# EAGLE design TiltyDuo (EAGLE 6.4)
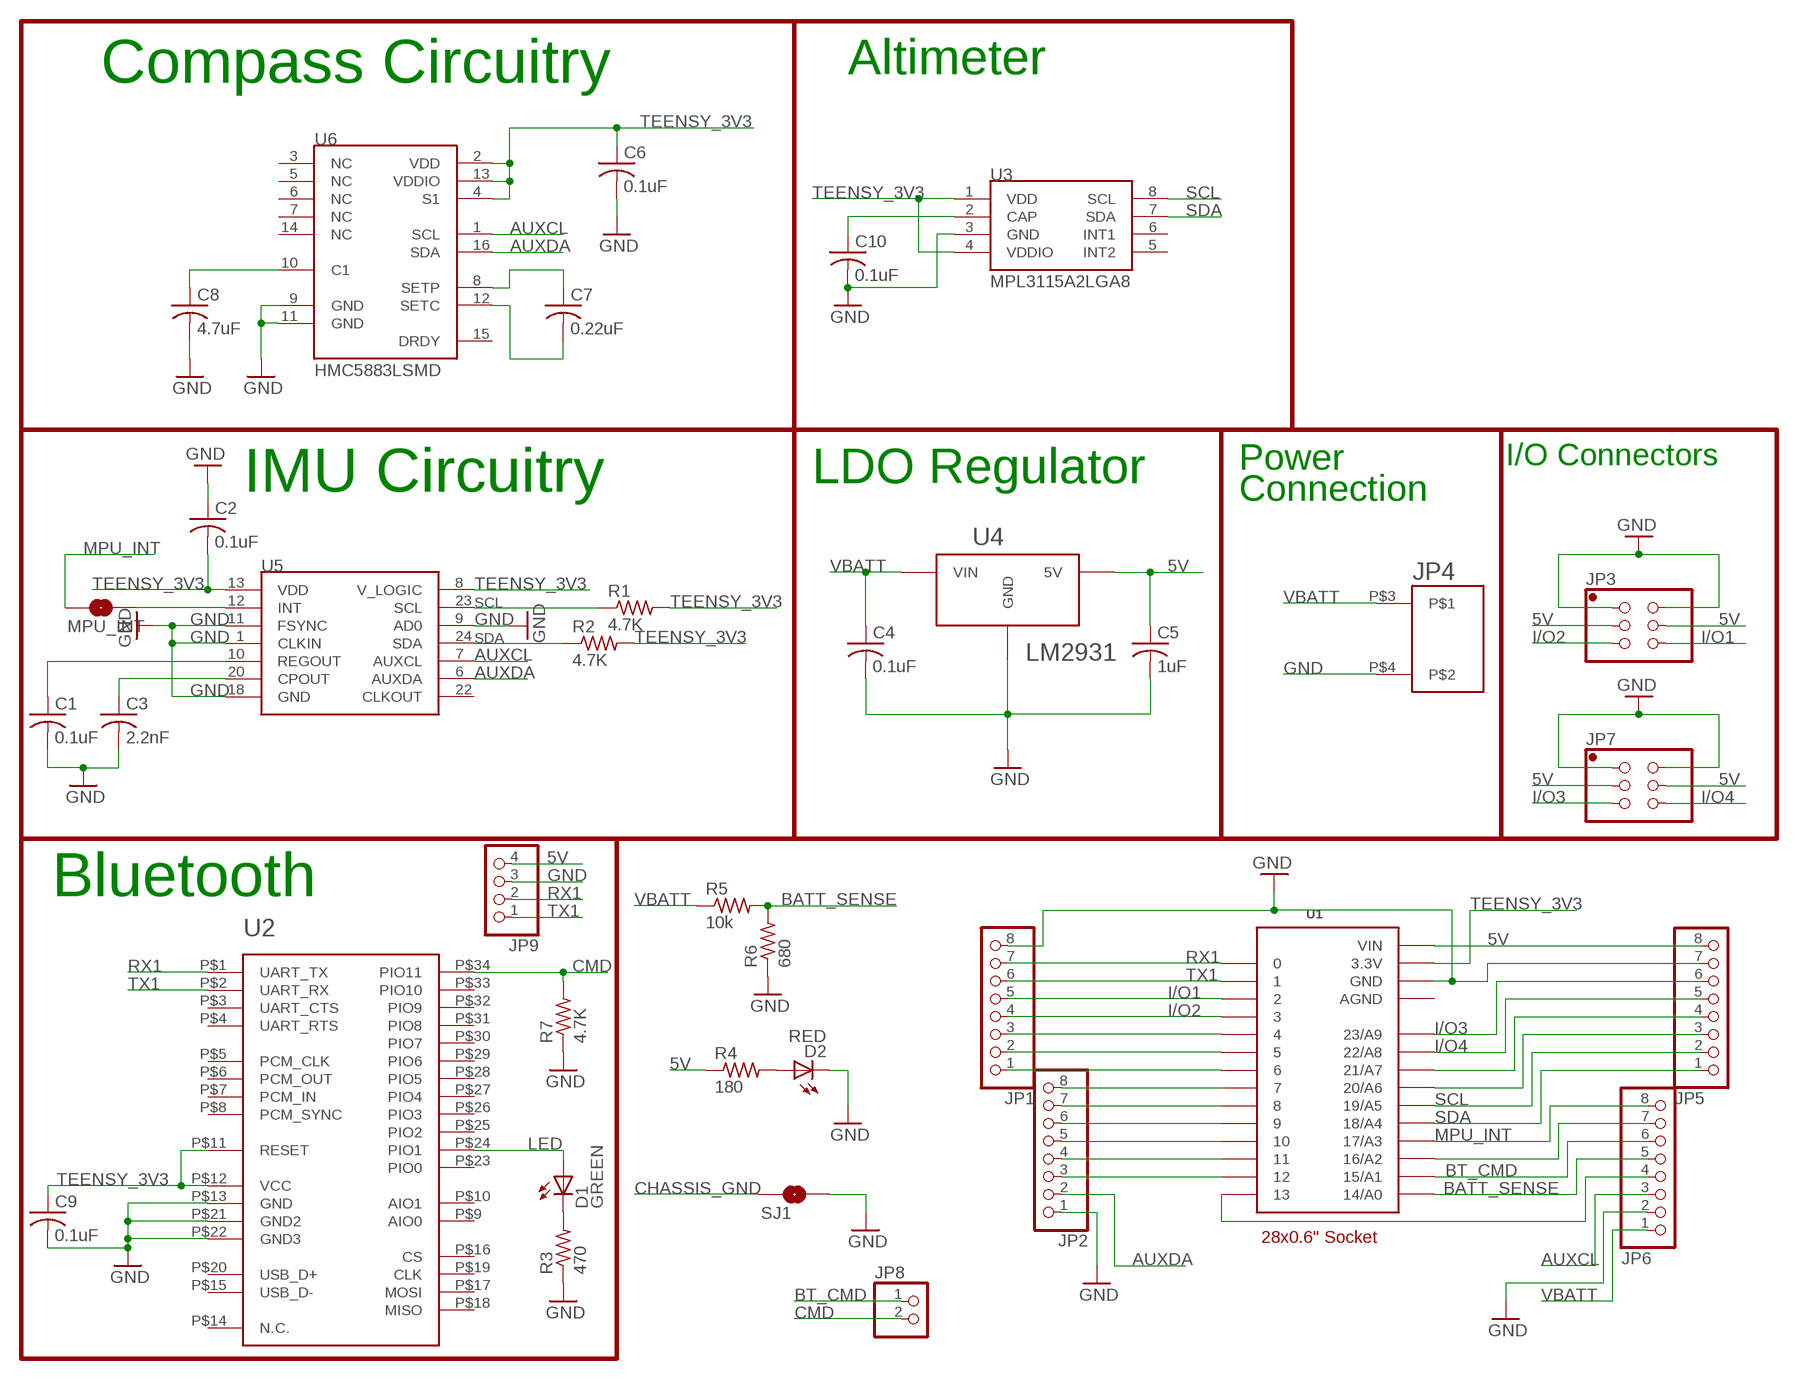
[diagram p0: schematic, sheet 1]

## Parts
C1  0.1uF  C-USC0402  [C0402]
C2  0.1uF  C-USC0402  [C0402]
C3  2.2nF  C-USC0402  [C0402]
C4  0.1uF  C-USC0603  [C0603]
C5  1uF  C-USC0603  [C0603]
C6  0.1uF  C-USC0402  [C0402]
C7  0.22uF  C-USC0402  [C0402]
C8  4.7uF  C-USC0402  [C0402]
C9  0.1uF  C-USC0402  [C0402]
C10  0.1uF  C-USC0402  [C0402]
D1  GREEN  LED-GREEN1206_NO_SILK  [LED-1206_NO_SS]
D2  RED  LED-GREEN1206_NO_SILK  [LED-1206_NO_SS]
JP1  PINHD-1X81X08_NO_SILK  [1X08_NO_SS]
JP2  PINHD-1X81X08_NO_SILK  [1X08_NO_SS]
JP3  PINHD-2X32X03_NO_SILK  [2X03_NO_SS]
JP4  2-POS_SMD_TERM_BLOCK  [2-POS_SMD_TERMINAL_BLOCK]
JP5  PINHD-1X81X08_NO_SILK  [1X08_NO_SS]
JP6  PINHD-1X81X08_NO_SILK  [1X08_NO_SS]
JP7  PINHD-2X32X03_NO_SILK  [2X03_NO_SS]
JP8  PINHD-1X21X02_NO_SILK  [1X02_NO_SS]
JP9  PINHD-1X4  [1X04]
MPU_INT  SOLDERJUMPERNO  [SJ_2S-NO]
R1  4.7K  R-US_R0402  [R0402]
R2  4.7K  R-US_R0402  [R0402]
R3  470  R-US_R0603  [R0603]
R4  180  R-US_R0603  [R0603]
R5  10k  R-US_R0603  [R0603]
R6  680  R-US_R0603  [R0603]
R7  4.7K  R-US_R0402  [R0402]
SJ1  SOLDERJUMPERNO  [SJ_2S-NO]
U1  TEENSY_3.0_OUTER-PINS28-DIP_SOCKET  [28-DIP]
U2  HC-09_BREAKOUT  [HC-09_BREAKOUT]
U3  MPL3115A2LGA8  [LGA8]
U4  LM2931  [TO263]
U5  MPU-6050  [QFN-24]
U6  HMC5883LSMD  [16LPCC]

## Nets
5V: C5.1 JP3.3 JP3.4 JP5.8 JP7.3 JP7.4 JP9.4 R4.1 U1.P$15(VIN) U4.P$3(5V)
AUXCL [I/O]: JP6.3 U5.7(AUXCL) U6.1(SCL)
AUXDA [I/O]: JP2.2 U5.6(AUXDA) U6.16(SDA)
BATT_SENSE: JP6.5 R5.2 R6.2 U1.P$27(14/A0)
BT_CMD: JP6.6 JP8.1 U1.P$26(15/A1)
CHASSIS_GND: SJ1.1
CMD: JP8.2 R7.2 U2.P$34(PIO11)
GND: C1.2 C2.1 C3.2 C4.2 C5.2 C6.2 C8.2 C9.2 C10.2 D2.C JP1.8 JP2.1 JP3.1 JP3.2 JP4.P$4 JP5.7 JP6.2 JP7.1 JP7.2 JP9.3 R3.1 R6.1 R7.1 SJ1.2 U1.P$1(GND) U2.P$13(GND) U2.P$21(GND2) U2.P$22(GND3) U3.3(GND) U4.P$1(GND) U5.1(CLKIN) U5.9(AD0) U5.11(FSYNC) U5.18(GND) U6.9(GND) U6.11(GND)
I/O1: JP1.5 JP3.6 U1.P$4
I/O2: JP1.4 JP3.5 U1.P$5
I/O3: JP5.6 JP7.5 U1.P$18(23/A9)
I/O4: JP5.5 JP7.6 U1.P$19(22/A8)
LED: D1.A U2.P$24(PIO1)
MPU_INT: JP6.8 MPU_INT.1 U1.P$24(17/A3)
N$1: C1.1 U5.10(REGOUT)
N$2: C3.1 U5.20(CPOUT)
N$3: D1.C R3.2
N$5: C7.1 U6.8(SETP)
N$6: C7.2 U6.12(SETC)
N$7: JP1.3 U1.P$6
N$8: JP1.2 U1.P$7
N$9: JP1.1 U1.P$8
N$10: JP6.4 U1.P$28
N$11: C8.1 U6.10(C1)
N$12: JP2.6 U1.P$11
N$13: JP2.5 U1.P$12
N$14: JP2.4 U1.P$13
N$15: JP2.3 U1.P$14
N$16: MPU_INT.2 U5.12(INT)
N$17: D2.A R4.2
N$18: JP5.4 U1.P$20(21/A7)
N$19: JP5.3 U1.P$21(20/A6)
N$21: C10.1 U3.2(CAP)
N$23: JP6.7 U1.P$25(16/A2)
RX1: JP1.7 JP9.2 U1.P$2 U2.P$1(UART_TX)
RX3: JP2.8 U1.P$9
SCL [I/O]: JP5.2 R1.1 U1.P$22(19/A5) U3.8(SCL) U5.23(SCL)
SDA [I/O]: JP5.1 R2.1 U1.P$23(18/A4) U3.7(SDA) U5.24(SDA)
TEENSY_3V3 [3.3V]: C2.2 C6.1 C9.1 R1.2 R2.2 U1.P$17(3.3V) U2.P$11(RESET) U2.P$12(VCC) U3.1(VDD) U3.4(VDDIO) U5.8(V_LOGIC) U5.13(VDD) U6.2(VDD) U6.4(S1) U6.13(VDDIO)
TX1: JP1.6 JP9.1 U1.P$3 U2.P$2(UART_RX)
TX3: JP2.7 U1.P$10
VBATT: C4.1 JP4.P$3 JP6.1 R5.1 U4.P$2(VIN)
Unconnected: U2.P$3(UART_CTS) U2.P$4(UART_RTS) U2.P$5(PCM_CLK) U2.P$6(PCM_OUT) U2.P$7(PCM_IN) U2.P$8(PCM_SYNC) U2.P$9(AIO0) U2.P$10(AIO1) U2.P$14(N.C.) U2.P$15(USB_D-) U2.P$16(CS) U2.P$17(MOSI) U2.P$18(MISO) U2.P$19(CLK) U2.P$20(USB_D+) U2.P$23(PIO0) U2.P$25(PIO2) U2.P$26(PIO3) U2.P$27(PIO4) U2.P$28(PIO5) U2.P$29(PIO6) U2.P$30(PIO7) U2.P$31(PIO8) U2.P$32(PIO9) U2.P$33(PIO10) U3.5(INT2) U3.6(INT1) U5.22(CLKOUT) U6.3(NC) U6.5(NC) U6.6(NC) U6.7(NC) U6.14(NC) U6.15(DRDY)

## Notes on the sheet
- Compass Circuitry | Altimeter
- Power | I/O Connectors
- IMU Circuitry | LDO Regulator
- Connection
- Bluetooth
- 28x0.6" Socket

## Power pins joined to a net without a drawn wire
AGND: U1.P$16(AGND)

## Library data of the parts
C1 C6 C9 C10 = resistor:C-US: CAPACITOR, American symbol; RATED_VOLTAGE: 2
C2 C4 C5 C7 C8 = resistor:C-US: CAPACITOR, American symbol
C3 = resistor:C-US: CAPACITOR, American symbol; RATED_VOLTAGE: 50
D1 D2 = SparkFun-LED:LED-GREEN: Various green LEDs 0603- DIO-00821 LARGE- DIO-00862 LILYPAD- DIO-09910
JP1 JP2 JP5 JP6 = pinhead:PINHD-1X8: PIN HEADER
JP3 JP7 = pinhead:PINHD-2X3: PIN HEADER
JP4 = My Parts:2-POS_SMD_TERM_BLOCK
JP8 = pinhead:PINHD-1X2: PIN HEADER
JP9 = pinhead:PINHD-1X4: PIN HEADER
MPU_INT SJ1 = SparkFun-Passives:SOLDERJUMPER: Solder Jumper Standard SMD solder jumper. Used to automate production. Two varients : Normally Open and Normally Closed are the same, but have different paste layers. NC will have a large amount of paste and should jumper during reflow.
R1-R7 = resistor:R-US_: RESISTOR, American symbol
U1 = My Parts:TEENSY_3.0_OUTER-PINS; COST: 0.28
U2 = csr:HC-09_BREAKOUT
U3 = SparkFun-Sensors:MPL3115A2: Altimeter/Pressure Sensor, I2C, 1.95V-3.6V supply, 50 to 110kPa
U4 = on-semiconductor:LM2931; COST: 0.53
U5 = SparkFun-Sensors:MPU-6050: MPU-6000 - I2C address is 0x68 with AD0 low and 0x69 with AD0 high.
U6 = SparkFun:HMC5883L: 3 Axis Digital Compass IC

## Board
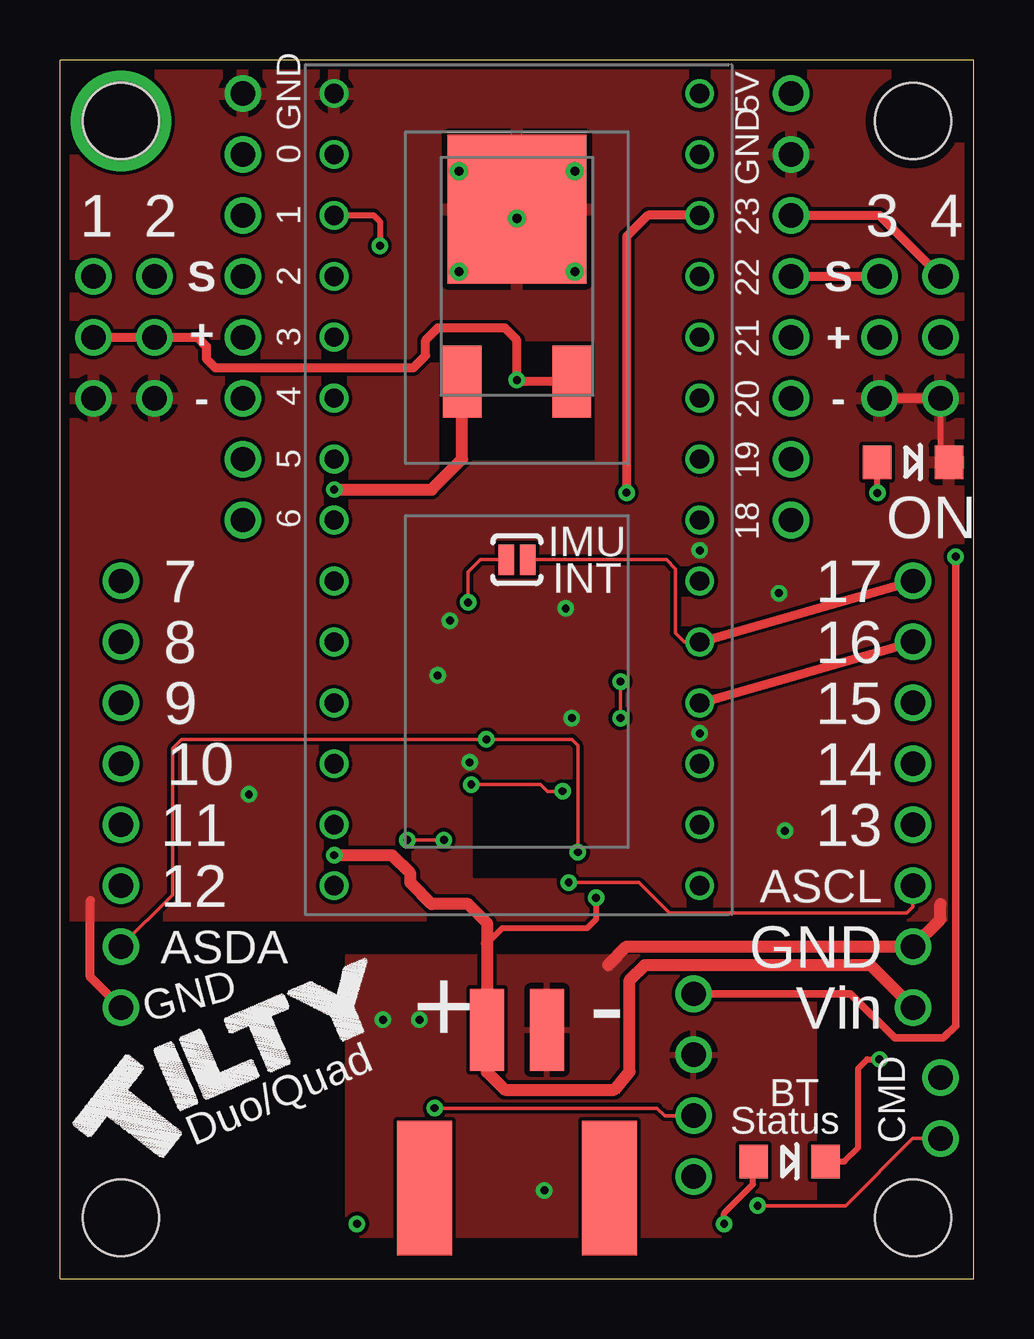
[diagram p1: board, top side]
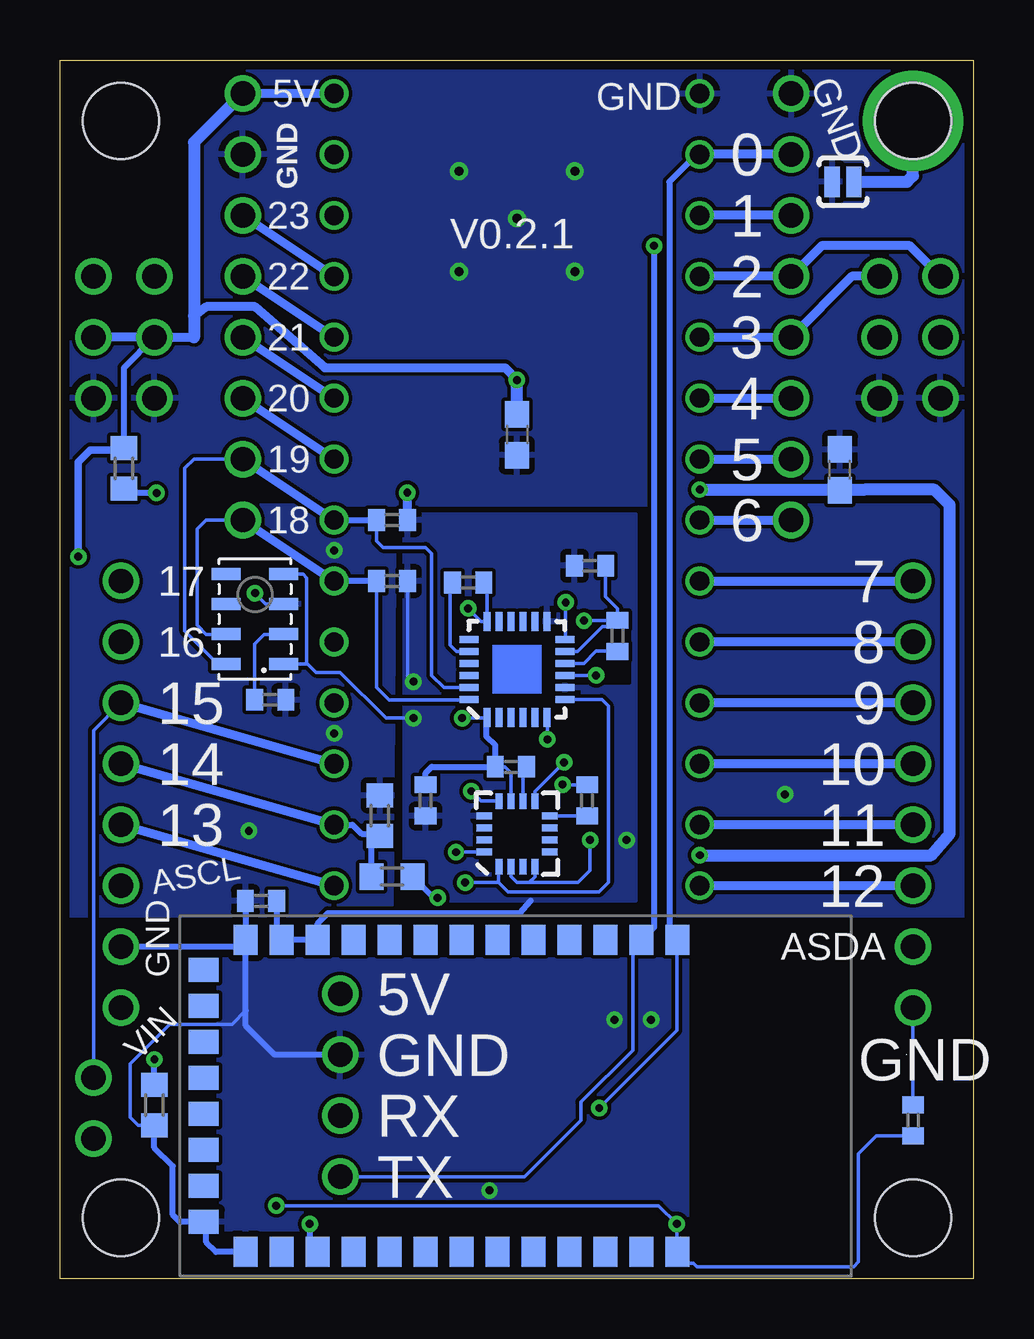
[diagram p2: board, bottom side, seen from below]

Size 38.1 x 50.8 mm. Coordinates in mm from the lower left corner, seen from the top.
Outline: 0,0 38.1,0 38.1,50.8 0,50.8 0,0
Copper layers (1*16): Top 0.0356mm / dielectric 1.5011mm / Bottom 0.0356mm
Design rules "LaenPCBOrder": minimum track width 6mil, minimum drill 13mil, track to track 6mil, track to pad 6mil, pad to pad 6mil, via to via 6mil, smd to smd 6mil, copper to edge 15mil, drill to drill 6mil, minimum pad ring 7mil, minimum via ring 7mil, stop-mask expansion 4mil, vias tented up to drill 0mil, thermal gap 10mil
Holes 3.17 mm at 35.56,48.26 35.56,2.54 2.54,2.54 2.54,48.26

### Footprints (pad centres in the part's own frame; a part is rotated, then mirrored left to right if it is on the bottom)
C0402 = smd 0.7 x 0.9: 1 -0.65,0; 2 0.65,0
C0603 = smd 1.1 x 1: 1 -0.85,0; 2 0.85,0
LED-1206_NO_SS = smd 1.2 x 1.4: A -1.5,0; C 1.5,0
1X08_NO_SS = drill 1.016: 1 -8.89,0; 2 -6.35,0; 3 -3.81,0; 4 -1.27,0; 5 1.27,0; 6 3.81,0; 7 6.35,0; 8 8.89,0
2X03_NO_SS = drill 1.016: 1 -2.54,-1.27; 2 -2.54,1.27; 3 0,-1.27; 4 0,1.27; 5 2.54,-1.27; 6 2.54,1.27
2-POS_SMD_TERMINAL_BLOCK = smd 2.3 x 5.6: P$1 -3.85,-2.325; P$2 3.85,-2.325 | smd 1.4 x 3.4: P$3 -1.25,4.275; P$4 1.25,4.275
1X02_NO_SS = drill 1.016: 1 -1.27,0; 2 1.27,0
1X04 = drill 1.016: 1 -3.81,0; 2 -1.27,0; 3 1.27,0; 4 3.81,0
SJ_2S-NO = smd 0.635 x 1.27: 1 -0.45,0; 2 0.45,0
R0402 = smd 0.7 x 0.9: 1 -0.65,0; 2 0.65,0
R0603 = smd 1 x 1.1: 1 -0.85,0; 2 0.85,0
28-DIP = drill 0.8: P$1 -7.62,16.51; P$2 -7.62,13.97; P$3 -7.62,11.43; P$4 -7.62,8.89; P$5 -7.62,6.35; P$6 -7.62,3.81; P$7 -7.62,1.27; P$8 -7.62,-1.27; P$9 -7.62,-3.81; P$10 -7.62,-6.35; P$11 -7.62,-8.89; P$12 -7.62,-11.43; P$13 -7.62,-13.97; P$14 -7.62,-16.51; P$15 7.62,16.51; P$16 7.62,13.97; P$17 7.62,11.43; P$18 7.62,8.89; P$19 7.62,6.35; P$20 7.62,3.81; P$21 7.62,1.27; P$22 7.62,-1.27; P$23 7.62,-3.81; P$24 7.62,-6.35; P$25 7.62,-8.89; P$26 7.62,-11.43; P$27 7.62,-13.97; P$28 7.62,-16.51
HC-09_BREAKOUT = smd 1.25 x 1: P$1 -6.5,10.5; P$2 -6.5,9; P$3 -6.5,7.5; P$4 -6.5,6; P$5 -6.5,3; P$6 -6.5,4.5; P$7 -6.5,1.5; P$8 -6.5,0; P$9 -6.5,-1.5; P$10 -6.5,-3; P$11 -6.5,-4.5; P$12 -6.5,-6; P$13 -6.5,-7.5; P$22 6.5,-7.5; P$23 6.5,-6; P$24 6.5,-4.5; P$25 6.5,-3; P$26 6.5,-1.5; P$27 6.5,0; P$28 6.5,1.5; P$29 6.5,3; P$30 6.5,4.5; P$31 6.5,6; P$32 6.5,7.5; P$33 6.5,9; P$34 6.5,10.5 | smd 1 x 1.25: P$14 -5.25,-9.25; P$15 -3.75,-9.25; P$16 -2.25,-9.25; P$17 -0.75,-9.25; P$18 0.75,-9.25; P$19 2.25,-9.25; P$20 3.75,-9.25; P$21 5.25,-9.25
LGA8 = smd 1.2 x 0.5: 1 -1.2,1.875; 2 -1.2,0.625; 3 -1.2,-0.625; 4 -1.2,-1.875; 5 1.2,-1.875; 6 1.2,-0.625; 7 1.2,0.625; 8 1.2,1.875
TO263 = smd 5.791 x 6.198: P$1 0,2.794 | smd 1.6 x 2.997: P$2 -2.286,-4.394; P$3 2.286,-4.394
QFN-24 = smd 0.8 x 0.3: 1 -2,1.25; 2 -2,0.75; 3 -2,0.25; 4 -2,-0.25; 5 -2,-0.75; 6 -2,-1.25; 13 2,-1.25; 14 2,-0.75; 15 2,-0.25; 16 2,0.25; 17 2,0.75; 18 2,1.25 | smd 0.3 x 0.8: 7 -1.25,-2; 8 -0.75,-2; 9 -0.25,-2; 10 0.25,-2; 11 0.75,-2; 12 1.25,-2; 19 1.25,2; 20 0.75,2; 21 0.25,2; 22 -0.25,2; 23 -0.75,2; 24 -1.25,2
16LPCC = smd 0.65 x 0.28: 1 -1.37,0.75; 2 -1.37,0.25; 3 -1.37,-0.25; 4 -1.37,-0.75; 9 1.37,-0.75; 10 1.37,-0.25; 11 1.37,0.25; 12 1.37,0.75 | smd 0.28 x 0.65: 5 -0.75,-1.37; 6 -0.25,-1.37; 7 0.25,-1.37; 8 0.75,-1.37; 13 0.75,1.37; 14 0.25,1.37; 15 -0.25,1.37; 16 -0.75,1.37

### Placement (x,y rotation side)
C1  14.86,26.8 90 bottom
C2  16,29.72 180 bottom
C3  21.08,29.02 0 bottom
C4  5.59,33.72 90 bottom
C5  19.05,35.18 270 bottom
C6  22.86,19.94 90 bottom
C7  16.13,19.94 90 bottom
C8  19.3,21.34 180 bottom
C9  29.72,15.75 180 bottom
C10  29.34,24.13 0 bottom
D1  30.42,4.89 0 top
D2  35.56,34.04 0 top
JP1  7.62,40.51 90 top
JP2  2.54,20.19 90 top
JP3  2.67,39.24 90 top
JP4  19.05,6.1 0 top
JP5  30.48,40.51 90 top
JP6  35.56,20.19 90 top
JP7  35.43,39.24 90 top
JP8  36.7,7.11 270 top
JP9  26.42,8.06 90 top
MPU_INT  19.05,29.97 180 top
R1  24.26,31.62 0 bottom
R2  24.26,29.08 0 bottom
R3  34.16,7.24 90 bottom
R4  35.43,33.78 270 bottom
R5  24.26,16.76 180 bottom
R6  24.77,19.3 270 bottom
R7  2.54,6.6 270 bottom
SJ1  5.46,45.72 180 bottom
U1  19.05,32.89 0 top
U2  22.86,7.62 270 bottom
U3  29.97,27.5 180 bottom
U4  19.05,41.78 0 top
U5  19.05,25.4 90 bottom
U6  19.05,18.54 90 bottom

### Tracks (layer width: path | path; a pad name or v marks a point on that pad's centre or on a via)
5V  (via drill 0.33)
  Top 0.318: JP9.4 32.96,11.87 34.8,10.03 36.83,10.03 37.34,10.54 v37.34,30.1
  Top 0.381: U4.P$3 19.13,37.39 v19.05,37.47 19.05,39.12 18.54,39.62 15.75,39.62 15.24,39.12 15.24,38.48 14.73,37.97 6.48,37.97 6.1,38.35 6.1,38.86 5.71,39.24 JP3.3 JP3.4
  Bottom 0.254: JP7.4 35.43,37.97 R4.1
  Bottom 0.318: v37.34,30.1 37.34,34.04 36.83,34.54 35.52,34.54 R4.1
  Bottom 0.381: U1.P$15 JP5.8 | 32.51,39.24 JP7.4 JP7.3 | v19.05,37.47 19.56,37.97 27.05,37.97 29.97,40.51 32,40.51 32.51,40.13
  Bottom 0.508: JP5.8 32.51,47.37 32.51,40.13 32.51,39.24 | C5.1 v19.05,37.47
AUXCL  (via drill 0.33)
  Top 0.152: v21.21,16.51 24.13,16.51 25.4,15.24 35.31,15.24 35.56,15.49 JP6.3
  Bottom 0.152: U5.7 15.51,24.15 15.24,23.88 15.24,16.51 15.62,16.13 19.43,16.13 19.81,16.51 | 19.81,16.51 19.81,17.16 U6.1 | 19.81,16.51 v21.21,16.51
AUXDA  (via drill 0.33)
  Top 0.152: v21.59,17.78 21.59,22.23 21.34,22.48 v17.78,22.48 5.08,22.48 4.7,22.1 4.7,16 JP2.2
  Bottom 0.152: v17.78,22.48 17.78,23.38 U5.6 | U6.16 21.32,17.79 v21.59,17.78
BATT_SENSE
  Bottom 0.254: R5.2 25.11,18.11 R6.2 24.85,18.54 25.53,18.54 25.91,18.92 U1.P$27
  Bottom 0.381: U1.P$27 JP6.5
BT_CMD
  Bottom 0.152: JP8.1 36.7,22.86 JP6.6
  Bottom 0.381: U1.P$26 JP6.6
CHASSIS_GND  (via drill 3.17)
  Bottom 0.508: SJ1.1 2.79,45.72 2.54,45.97 v2.54,48.26
CMD  (via drill 0.33)
  Top 0.152: JP8.2 35.56,5.84 32.77,3.05 v29.08,3.05
  Bottom 0.152: v29.08,3.05 13.14,3.05 v12.38,2.29 12.38,1.14 U2.P$34 | 12.38,1.1 U2.P$34 | R7.2 4.08,5.95 4.83,5.21 4.83,0.7 5.02,0.51 11.56,0.51 11.68,0.64 12,0.64 U2.P$34
GND  (via drill 0.33, 0.38 pad 0.18)
  Top 0.254: JP7.1 36.7,34.39 D2.C
  Top 0.381: JP7.2 JP7.1 | JP2.1 1.27,12.57 1.27,15.75
  Top 0.508: 36.7,15.62 36.7,14.99 JP6.2 23.62,13.84 22.86,13.08
  Bottom 0.152: C8.2 19.56,21.34 19.3,21.08 U6.11 | C3.2 20.3,28.9 U5.18 20.54,27.4 v21.08,27.94 | v15.75,25.15 U5.9 | U5.11 16.52,26.15 15.49,27.18 15.13,27.18 C1.2 | v16.26,27.43 14.87,27.43 C1.2 | 20.32,23.38 21.32,23.38 v21.34,23.37 | C2.1 15.35,28.43 14.86,27.94 C1.2 | U6.9 18.3,20.31 v17.08,21.53 | R3.1 34.84,6.39 35.18,6.73 35.18,8.95 33.53,10.6 30.92,10.6 30.35,11.18 | R7.1 JP2.1 | U3.3 29.52,28.12 v29.97,28.57
  Bottom 0.254: C6.2 22.86,21.08 22.61,21.34 C8.2 19.95,22.24 20.32,22.61 20.32,23.38 U5.1 | JP6.2 30.64,13.84 U2.P$13 | U2.P$22 31.6,1.12 32,1.52 32,2.26 U2.P$21 33.1,2.37 33.4,2.67 33.4,4.7 34.16,5.46 R3.1 | C9.2 U2.P$13 | U2.P$13 30.36,13.98 | JP9.3 29.15,9.34 30.35,10.54 30.35,11.18 U2.P$13
  other vias: 19.05,44.2 16.64,41.97 21.46,41.97 21.46,46.16 16.64,46.16 7.87,20.19 26.67,30.35 26.67,22.73 30.23,18.67 20.19,3.68 13.46,10.79 14.99,10.79
  pour Top (isolate 0.127): 0,50.8 38.1,50.8 38.1,15.11 0,15.11
  pour Bottom: 0,32.26 0,50.8 38.1,50.8 38.1,32.26
  pour Bottom: 0,32.26 13.72,32.26 13.72,15.11 0,15.11
  pour Bottom: 24.13,32.26 37.97,32.26 38.1,15.11 24.26,15.11
  pour Bottom: 11.94,13.34 31.5,13.34 31.5,2.03 11.94,2.03
  pour Top: 11.94,13.46 31.5,13.46 31.5,1.78 11.94,1.78
I/O1
  Bottom 0.381: U1.P$4 JP1.5 6.35,43.05 2.67,43.05 JP3.6
I/O2
  Bottom 0.381: U1.P$5 JP1.4 5.08,41.78 JP3.5
I/O3
  Top 0.381: JP5.6 34.16,44.32 JP7.5
  Bottom 0.381: U1.P$18 JP5.6
I/O4
  Top 0.381: JP5.5 JP7.6
  Bottom 0.381: U1.P$19 JP5.5
LED  (via drill 0.33)
  Top 0.254: v27.69,2.29 27.69,2.73 28.89,3.94 28.89,4.87 D1.A
  Bottom 0.254: v27.69,2.29 27.69,1.45 U2.P$24
MPU_INT
  Top 0.152: MPU_INT.1 25.27,29.97 25.65,29.59 25.65,26.92 26.04,26.54 U1.P$24
  Top 0.381: U1.P$24 JP6.8
N$1
  Bottom 0.152: U5.10 16.26,25.65 15.75,26.16 14.87,26.16 C1.1
N$2
  Bottom 0.152: U5.20 21.58,26.15 21.84,26.42 21.84,28.91 C3.1
N$3  (via drill 0.33)
  Top 0.254: D1.C 32.7,4.89 33.27,5.46 33.27,8.76 33.66,9.14 v34.16,9.14
  Bottom 0.254: R3.2 v34.16,9.14
N$4
  cutout Top: 17.27,20.32 17.27,16.76 20.32,16.76 20.83,17.27 20.83,20.32
N$5
  Bottom 0.152: C7.1 U6.8
N$6  (via drill 0.33 pad 0.18)
  Top 0.152: v17.14,20.6 20.04,20.6 20.32,20.32 v20.95,20.32
  Bottom 0.152: C7.2 17.02,20.59 v17.14,20.6 | U6.12 20.55,19.91 v20.95,20.32
N$7
  Bottom 0.381: U1.P$6 JP1.3
N$8
  Bottom 0.381: U1.P$7 JP1.2
N$9
  Bottom 0.381: U1.P$8 JP1.1
N$10
  Bottom 0.381: U1.P$28 JP6.4
N$11
  Bottom 0.152: U6.10 18.8,21.32 C8.1
N$12
  Bottom 0.381: JP2.6 U1.P$11
N$13
  Bottom 0.381: JP2.5 U1.P$12
N$14
  Bottom 0.381: JP2.4 U1.P$13
N$15
  Bottom 0.381: JP2.3 U1.P$14
N$16  (via drill 0.33)
  Top 0.152: v17.02,28.19 17.02,29.46 17.53,29.97 MPU_INT.2
  Bottom 0.152: v17.02,28.19 17.02,26.68 U5.12
N$17  (via drill 0.33)
  Top 0.254: v34.08,32.75 D2.A
  Bottom 0.254: v34.08,32.75 35.25,32.75 R4.2
N$18
  Bottom 0.381: U1.P$20 JP5.4
N$19
  Bottom 0.381: U1.P$21 JP5.3
N$20
  cutout Top: 15.88,38.99 22.23,38.99 22.23,34.16 15.88,34.16
N$21
  Bottom 0.152: C10.1 29.99,26.46 29.59,26.86 28.78,26.86 U3.2
N$22
  cutout Bottom: 17.27,27.18 20.83,27.18 20.83,23.62 17.27,23.62
N$23
  Top 0.381: U1.P$25 JP6.7
N$24
  cutout Bottom: 17.53,20.07 17.53,17.02 20.57,17.02 20.57,20.07
N$26
  cutout Bottom: 14.35,27.81 16.76,27.81 16.76,24.83 14.35,24.83
N$27
  cutout Bottom: 15.49,19.05 19.56,19.05 19.56,16.38 15.49,16.38
N$28
  cutout Bottom: 28.57,29.84 31.37,29.84 31.37,25.15 28.57,25.15
RX1  (via drill 0.33)
  Top 0.152: JP9.2 25.21,6.79 24.89,7.11 v15.62,7.11
  Bottom 0.152: v15.62,7.11 12.38,10.35 12.38,14.1 U2.P$1
  Bottom 0.254: U1.P$2 11.56,46.86 12.7,45.72 12.7,14.59 U2.P$1
  Bottom 0.381: JP1.7 U1.P$2
RX3
  Bottom 0.381: U1.P$9 JP2.8
SCL
  Bottom 0.152: R1.1 24.91,30.75 24.64,30.48 22.86,30.48 22.61,30.23 22.61,25.15 22.1,24.64 21.06,24.64 U5.23 | U3.8 31.53,25.62 32.89,26.99 32.89,33.78 32.51,34.16 JP5.2
  Bottom 0.254: U1.P$22 R1.1
  Bottom 0.381: U1.P$22 JP5.2
SDA
  Bottom 0.152: R2.1 24.91,24.65 24.38,24.13 21.07,24.13 U5.24 | JP5.1 32,31.62 32.38,31.24 32.38,27.24 32,26.86 31.18,26.86 U3.7
  Bottom 0.254: R2.1 U1.P$23
  Bottom 0.381: U1.P$23 JP5.1
TEENSY_3V3  (via drill 0.33)
  Top 0.152: v23.37,23.37 v23.37,24.89 | v14.48,18.29 v16,18.29
  Top 0.381: U1.P$17 24.51,44.32 23.62,43.43 v23.62,32.77
  Bottom 0.152: U6.4 18.3,16.75 18.54,16.51 | U6.2 19.3,16.76 19.05,16.51 18.54,16.51 | R2.2 23.61,25.13 v23.37,24.89 | 18.54,16.51 16.51,16.51 16,17.02 v16,18.29 | U3.1 27.78,25.62 | 27.78,25.62 27.43,25.27 26.42,25.27 24.51,23.37 v23.37,23.37 | U3.4 27.97,29.37 27.81,29.21 27.81,25.65 27.78,25.62
  Bottom 0.254: 18.48,15.75 18.92,15.24 26.92,15.24 27.36,14.8 U2.P$11 U2.P$12 29.07,14.33 C9.1
  Bottom 0.381: v23.62,32.77 23.62,31.64 R1.2
  pour Bottom: 14.1,31.88 23.75,31.88 23.75,15.75 14.1,15.75
TX1  (via drill 0.33)
  Top 0.254: U1.P$3 13.08,44.32 13.34,44.07 v13.34,43.05
  Bottom 0.152: JP9.1 18.73,4.25 16.38,6.6 16.38,7.37 14.22,9.53 14.22,13.76 U2.P$2
  Bottom 0.254: v13.34,43.05 13.34,14.64 U2.P$2
  Bottom 0.381: JP1.6 U1.P$3
TX3
  Bottom 0.254: U1.P$10 11.3,26.54
  Bottom 0.381: JP2.7 U1.P$10
VBATT  (via drill 0.33)
  Top 0.254: v22.35,15.88 22.35,14.99 21.97,14.61 18.43,14.61 17.8,13.97
  Top 0.381: 16.75,37.37 U4.P$2
  Top 0.508: 16.68,37.3 U4.P$2 16.76,34.16 15.49,32.89 v11.43,32.89 | v11.43,17.65 13.84,17.65 14.61,16.89 14.61,16.51 15.49,15.62 17.02,15.62 17.8,14.84 17.8,13.97 JP4.P$3 17.8,8.62 18.54,7.87 23.11,7.87 23.75,8.64 23.75,12.45 24.38,13.08 33.78,13.08 JP6.1
  Bottom 0.254: v22.35,15.88 22.52,15.88 R5.1
  Bottom 0.508: v11.43,17.65 1.78,17.65 1.02,18.54 1.02,32.26 1.65,32.89 4.57,32.89 | v11.43,32.89 4.57,32.89 | 4.57,32.89 C4.1

### Text on the board
tNames: 5V | GND | 0 | GND | 1 | 2 | 1 | 3 | 4 | 23 | S | S | 2 | 22 | + | 3 | + | 21 | - | - | 4 | 20 | 5 | 19 | ON | 6 | IMU | 18 | INT | 17 | 7 | 16 | 8 | 15 | 9 | 10 | 14 | 11 | 13 | 12 | ASCL | ASDA | GND | GND | + | - | Vin | BT | Status | Duo/Quad | CMD
bNames: GND | 5V | GND | GND | 0 | 1 | V0.2.1 | 23 | 2 | 22 | 3 | 21 | 4 | 20 | 5 | 19 | 6 | 18 | 7 | 17 | 8 | 16 | 9 | 15 | 10 | 14 | 11 | 13 | ASCL | 12 | ASDA | GND | 5V | GND | GND | VIN | RX | TX